# Altium schematic sheet 100_PowerSupply.SchDoc
size A3; SheetNumber: 11; SheetTotal: 12
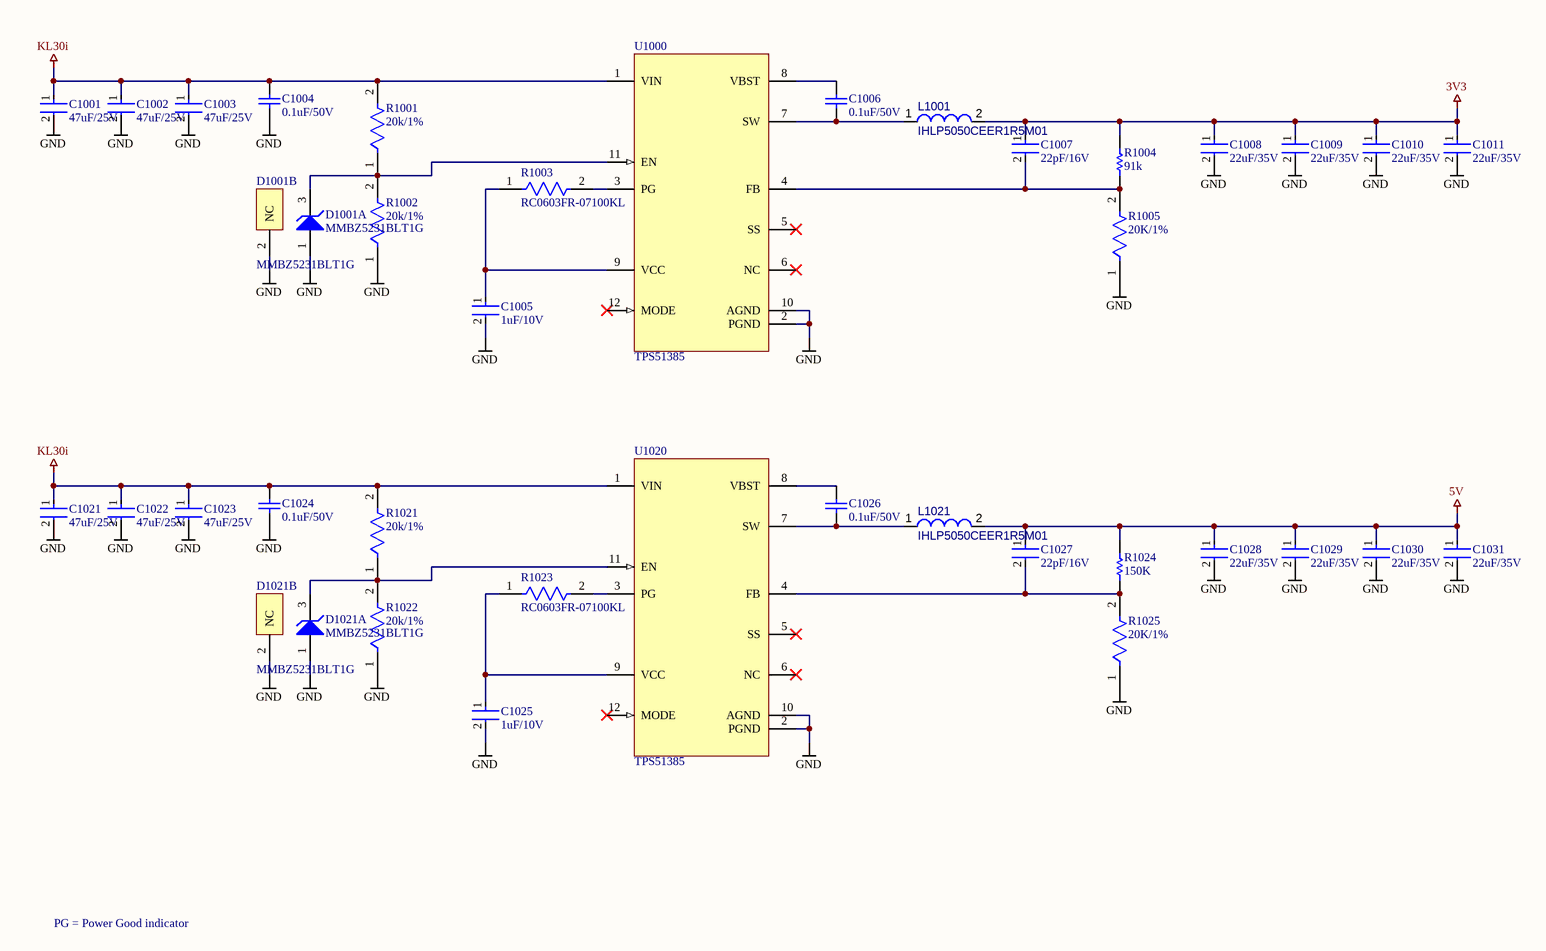
[diagram p0: 100_PowerSupply.SchDoc]

## Parts
C1001  47uF/25V  [FP-C3216-160-0_2-MFG]
C1002  47uF/25V  [FP-C3216-160-0_2-MFG]
C1003  47uF/25V  [FP-C3216-160-0_2-MFG]
C1004  0.1uF/50V  [CAPC2013X135X45ML10T25]
C1005  1uF/10V  [FP-C0603-CG-MFG]
C1006  0.1uF/50V  [CAPC2013X135X45ML10T25]
C1007  22pF/16V  [FP-C0603C-CF-MFG]
C1008  22uF/35V  [FP-C3216-160-0_2-IPC_B]
C1009  22uF/35V  [FP-C3216-160-0_2-IPC_B]
C1010  22uF/35V  [FP-C3216-160-0_2-IPC_B]
C1011  22uF/35V  [FP-C3216-160-0_2-IPC_B]
C1021  47uF/25V  [FP-C3216-160-0_2-MFG]
C1022  47uF/25V  [FP-C3216-160-0_2-MFG]
C1023  47uF/25V  [FP-C3216-160-0_2-MFG]
C1024  0.1uF/50V  [CAPC2013X135X45ML10T25]
C1025  1uF/10V  [FP-C0603-CG-MFG]
C1026  0.1uF/50V  [CAPC2013X135X45ML10T25]
C1027  22pF/16V  [FP-C0603C-CF-MFG]
C1028  22uF/35V  [FP-C3216-160-0_2-IPC_B]
C1029  22uF/35V  [FP-C3216-160-0_2-IPC_B]
C1030  22uF/35V  [FP-C3216-160-0_2-IPC_B]
C1031  22uF/35V  [FP-C3216-160-0_2-IPC_B]
D1001  MMBZ5231BLT1G  [ONSC-SOT-23-3-318-08_V]  (parts A,B of 2)
D1021  MMBZ5231BLT1G  [ONSC-SOT-23-3-318-08_V]  (parts A,B of 2)
L1001  IHLP5050CEER1R5M01  [IHLP5050CEER1R5M01]
L1021  IHLP5050CEER1R5M01  [IHLP5050CEER1R5M01]
R1001  20k/1%  [FP-RC0603-0_55-IPC_C]
R1002  20k/1%  [FP-RC0603-0_55-IPC_C]
R1003  RC0603FR-07100KL  [FP-RC0603-0_55-MFG]
R1004  91k  [RESC1609X50X30NL10T20]
R1005  20K/1%  [FP-RC0603-0_55-IPC_C]
R1021  20k/1%  [FP-RC0603-0_55-IPC_C]
R1022  20k/1%  [FP-RC0603-0_55-IPC_C]
R1023  RC0603FR-07100KL  [FP-RC0603-0_55-MFG]
R1024  150K  [RESC1608X55X30NL15T15]
R1025  20K/1%  [FP-RC0603-0_55-IPC_C]
U1000  TPS51385  [TPS51386]
U1020  TPS51385  [TPS51386]

## Nets
3V3: C1007.1 C1008.1 C1009.1 C1010.1 C1011.1 L1001.2 R1004.2
5V: C1027.1 C1028.1 C1029.1 C1030.1 C1031.1 L1021.2 R1024.2
GND: C1001.2 C1002.2 C1003.2 C1004.1 C1005.2 C1008.2 C1009.2 C1010.2 C1011.2 C1021.2 C1022.2 C1023.2 C1024.1 C1025.2 C1028.2 C1029.2 C1030.2 C1031.2 D1001.1(A) D1001.2(NC) D1021.1(A) D1021.2(NC) R1002.1 R1005.1 R1022.1 R1025.1 U1000.2(PGND) U1000.10(AGND) U1020.2(PGND) U1020.10(AGND)
KL30i: C1001.1 C1002.1 C1003.1 C1004.2 C1021.1 C1022.1 C1023.1 C1024.2 R1001.2 R1021.2 U1000.1(VIN) U1020.1(VIN)
NetC1005_1: C1005.1 R1003.1 U1000.9(VCC)
NetC1006_1: C1006.1 L1001.1 U1000.7(SW)
NetC1006_2: C1006.2 U1000.8(VBST)
NetC1007_2: C1007.2 R1004.1 R1005.2 U1000.4(FB)
NetC1025_1: C1025.1 R1023.1 U1020.9(VCC)
NetC1026_1: C1026.1 L1021.1 U1020.7(SW)
NetC1026_2: C1026.2 U1020.8(VBST)
NetC1027_2: C1027.2 R1024.1 R1025.2 U1020.4(FB)
NetD1001_3: D1001.3(K) R1001.1 R1002.2 U1000.11(EN)
NetD1021_3: D1021.3(K) R1021.1 R1022.2 U1020.11(EN)
NetR1003_2: R1003.2 U1000.3(PG)
NetR1023_2: R1023.2 U1020.3(PG)

Not connected (* = marked no-connect by the designer): U1000 5(SS)* 6(NC)* 12(MODE)*; U1020 5(SS)* 6(NC)* 12(MODE)*

## Notes on the sheet
- PG = Power Good indicator

## Library data of the parts
C1001-C1003 C1021-C1023 = CMP-2000-05397-3: Multilayer Ceramic Capacitors 47uF ±20% 25V X5R SMD 1206 / C3216X5R1E476M160AC; Weight: 0.000571oz; Dielectric: X5R; Length: 0.126inch; Voltage Rating: 25V; Case/Package: 1206; Dielectric Material: Ceramic; Min Operating Temperature: -55°C; Lead Free: Lead Free; Packaging: Tape and Reel; Package Quantity: 1; Mount: Surface Mount; Depth: 1.6mm; REACH SVHC: No SVHC; Termination: SMD/SMT; Case Code (Imperial): 1206; Series: C; Resistor Type: Ceramic; Voltage: 25V; Width: 0.063inch; Height: 1.6mm; Tolerance: 20%; Capacitance: 47uF; Max Operating Temperature: 85°C; Voltage Rating (DC): 25V; RoHS Compliant: Yes; Thickness: 0.071inch; Case Code (Metric): 3216
C1004 C1006 C1024 C1026 = CMP-2100-03644-1: Chip Capacitor, 0.1 uF, +/- 10%, 50 V, -55 to 125 degC, 0805 (2012 Metric), RoHS, Tape and Reel / GRM21BR71H104KA01L; Manufacturer: Murata; Voltage: 50V; Capacitance: 100nF; Insulation Resistance: 10GR; Dielectric Material: Ceramic; Dielectric: X7R; Package Description: 2-Pin Surface Mount Device, Body 2 x 1.25 mm; Manufacturer URL: http://www.murata.com/; Case Code (Imperial): 0805; Datasheet URL: http://psearch.en.murata.com/capacitor/product/GRM21BR71H104KA01%23.pdf; Termination: SMD/SMT; Lead Free: LeadFree; Package Quantity: 1; Mount: SurfaceMount; REACH SVHC: Unknown; Thickness: 0.053inch; Height: 1.25mm; Case/Package: 0805; Voltage Rating: 50V; Width: 0.049inch; Case Code (Metric): 2012; Material: Ceramic; Min Operating Temperature: -55degC; RoHSCompliant: true; Datasheet Version: 42675.0; Voltage Rating (DC): 50V; Tolerance: 10%; Package Reference: 0805; Depth: 1.25mm; Length: 2mm; Max Operating Temperature: 125degC; Packaging: TapeandReel; Number of Pins: 2; Radiation Hardening: No
C1005 C1025 = CMP-2006-02243-2: CAP CER 1UF 10V Y5V 0603 / C0603C105Z8VACTU; Dielectric Material: Ceramic; Tolerance: 80%; Dissipation Factor: 10%; Case/Package: 0603; Width: 0.8mm; Radiation Hardening: No; Lead Pitch: 0.7mm; Termination: SMD/SMT; Min Operating Temperature: -30°C; Voltage Rating (DC): 10V; Length: 1.6mm; Packaging: Tape and Reel; Mount: Surface Mount; REACH SVHC: No SVHC; Series: C; Case Code (Imperial): 0603; Package Quantity: 1; Thickness: 0.035inch; Capacitance: 1uF; Height: 0.8mm; Dielectric: Y5V; Construction: Flat; Lead Free: Lead Free; Case Code (Metric): 1608; Max Operating Temperature: 85°C; Voltage Rating: 10V; Depth: 0.8mm; RoHS Compliant: Yes
C1007 C1027 = CMP-2006-03465-2: CAP CER 22PF 16V 10% NP0 0603 / C0603C220K4GACTU; Manufacturer: KEMET; Temperature Characteristic: C0G; Temperature Coefficient: 30ppm/°C; Tolerance: 0.1; Material: Ceramic; Automotive Grade: Grade 1; ComponentLink2URL: https://api.kemet.com/component-edge/download/datasheet/C0603C100J5GACAUTO.pdf; Mouser Description: Multilayer Ceramic Capacitors MLCC - SMD/SMT 16volts 22pF C0G 10%; Package: C0603C-CF; Height: 0.87mm; Device Class L1: Passive Components; ComponentLink2Description: Datasheet; Device Class L3: Ceramic Capacitors; Device Class L2: Capacitors; Value: 22 pF; Temperature Range High: +125°C; Automotive: Yes; Digikey Description: CAP CER 22PF 16V 10% NP0 0603; Category: Cap; Capacitance: 22 pF; Manufacturer Part Number: C0603C220K4GACTU; RoHS: TRUE; Octopart: https://octopart.com/c0603c220k4gactu-kemet-17097913; Temperature: -55°C to +125°C; Lead Free: Yes; Temperature Range Low: -55°C; Voltage Rating: 16 V
C1008-C1011 C1028-C1031 = CMP-2000-05398-2: Multilayer Ceramic Capacitors 22uF ±20% 35V X5R SMD 1206 / C3216X5R1V226M160AC; Mount: Surface Mount; Voltage Rating: 35V; Length: 3.2mm; Case/Package: 1206; Width: 0.063inch; Dielectric Material: Ceramic; Series: C; Voltage Rating (DC): 35V; Construction: Flat; Tolerance: 20%; Dielectric: X5R; Voltage: 35V; Min Operating Temperature: -55°C; Case Code (Metric): 3216; Termination: SMD/SMT; Capacitance: 22uF; Resistor Type: Ceramic; RoHS Compliant: Yes; Height: 1.6mm; Depth: 1.6mm; Radiation Hardening: No; Package Quantity: 2000; REACH SVHC: No SVHC; Case Code (Imperial): 1206; Weight: 0.000571oz; Max Operating Temperature: 85°C; Packaging: Tape and Reel; Thickness: 1.6mm; Lead Free: Lead Free
D1001 D1021 = CMP-1060-00985-1: Zener Voltage Regulator, 225 mW, 3-Pin SOT-23, Pb-Free, Tape and Reel; Manufacturer: On Semiconductor; VZ Typ (V): 5.1; Packing: Tape and Reel; ComponentLink1Description: Manufacturer URL; PartNumber: MMBZ5231BLT1G; PackageReference: SOT-23-3-318-08; ComponentLink1URL: http://www.onsemi.com/; ComponentLink3URL: http://www.onsemi.cn/pub_link/Collateral/318-08.PDF; Mounting Technology: Surface Mount; ComponentLink2Description: Datasheet; DatasheetVersion: Rev. 12; ComponentLink3Description: Package Specification; PackageVersion: Rev. AP, 11/2009; ComponentLink2URL: http://www.onsemi.cn/pub_link/Collateral/MMBZ5221BLT1-D.PDF; RoHS: Pb-Free; PackageDescription: 3-Pin Small Outline Transistor, Body 2.92 x 1.3 mm, Pitch 0.95 mm
L1001 L1021 = IHLP5050CEER1R5M01: Chip Inductor, 1.5 uH, +/- 20% / IHLP5050CEER1R5M01
R1001 R1002 R1005 R1021 R1022 R1025 = CMP-2000-06932-2: RES 20K OHM 1% 1/10W 0603 / RC0603FR-0720KL; Voltage Rating: 50V; Temperature Coefficient: 100ppm/°C; Power Rating: 100mW; Resistance: 20kR; Height: 0.022inch; REACH SVHC: No SVHC; Case Code (Metric): 1608; Depth: 0.8mm; Tolerance: 1%; Min Operating Temperature: -55°C; Series: RC; RoHS Compliant: Yes; Resistor Type: Thick Film; Max Power Dissipation: 100mW; Features: Moisture Resistant; Max Operating Temperature: 155°C; Package Quantity: 1; Size Code: 0603; Packaging: Tape and Reel; Width: 0.031inch; Length: 0.063inch; Military Standard: Not; Technology: THICK FILM; Number of Terminations: 2; Termination: SMD/SMT; Construction: Rectangular; Case/Package: 0603; Number of Pins: 2; Lead Free: Lead Free; Voltage Rating (DC): 50V; Resistance Tolerance: 1%; Case Code (Imperial): 0603
R1003 R1023 = CMP-2100-03662-2: RES SMD 100K OHM 1% 1/10W 0603; Voltage Rating (DC): 50V; Resistance: 100kR; Max Power Dissipation: 100mW; Temperature Coefficient: 100ppm/°C; Working Voltage: 75V; Length: 1.6mm; Lead Free: Lead Free; Number of Terminations: 2; Packaging: Tape and Reel; Voltage Rating: 50V; Termination: SMD/SMT; Width: 0.8mm; Resistor Type: Thick Film; Resistance Tolerance: 1%; Features: Moisture Resistant; Height: 0.45mm; Construction: Rectangular; Case/Package: 0603; Military Standard: Not; Case Code (Imperial): 0603; Series: RC; Technology: THICK FILM; Depth: 0.8mm; RoHS Compliant: Yes; REACH SVHC: No SVHC; Min Operating Temperature: -55°C; Case Code (Metric): 1608; Max Operating Temperature: 155°C; Power Rating: 100mW; Number of Pins: 2; Tolerance: 1%
R1004 = CMP-2000-03640-1: CRCW060391K0FKEA; Manufacturer: Vishay Dale; Part Number: CRCW060391K0FKEA
R1024 = CMP-1012-00754-2: ERJ-3EKF1503V; Manufacturer: Panasonic; Part Number: ERJ-3EKF1503V
U1000 U1020 = TPS51386: 8A Synchronous Buck Converter - TPS51386